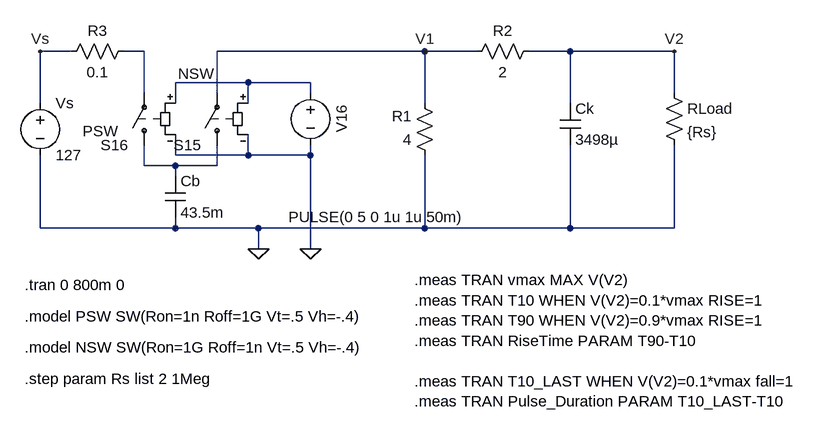
[diagram p0: schematic Pulse generator.asc]
Pulse generator.asc, the LTspice schematic file:
Version 4
SHEET 1 2832 884
WIRE 1488 -464 1440 -464
WIRE 1600 -464 1568 -464
WIRE 2032 -464 1712 -464
WIRE 2112 -464 2032 -464
WIRE 2256 -464 2192 -464
WIRE 2416 -464 2256 -464
WIRE 1760 -416 1648 -416
WIRE 1856 -416 1760 -416
WIRE 1600 -400 1600 -464
WIRE 1712 -400 1712 -464
WIRE 1856 -400 1856 -416
WIRE 2416 -400 2416 -464
WIRE 1440 -384 1440 -464
WIRE 1648 -384 1648 -416
WIRE 1760 -384 1760 -416
WIRE 2032 -384 2032 -464
WIRE 2256 -384 2256 -464
WIRE 1648 -304 1648 -336
WIRE 1760 -304 1760 -336
WIRE 1760 -304 1648 -304
WIRE 1856 -304 1856 -320
WIRE 1856 -304 1760 -304
WIRE 1600 -288 1600 -320
WIRE 1648 -288 1600 -288
WIRE 1712 -288 1712 -320
WIRE 1712 -288 1648 -288
WIRE 1648 -272 1648 -288
WIRE 1440 -192 1440 -304
WIRE 1648 -192 1648 -208
WIRE 1648 -192 1440 -192
WIRE 1776 -192 1648 -192
WIRE 2032 -192 2032 -304
WIRE 2032 -192 1776 -192
WIRE 2256 -192 2256 -320
WIRE 2256 -192 2032 -192
WIRE 2416 -192 2416 -320
WIRE 2416 -192 2256 -192
WIRE 1776 -160 1776 -192
WIRE 1856 -160 1856 -304
FLAG 1776 -160 0
FLAG 1856 -160 0
FLAG 2416 -464 V2
FLAG 2032 -464 V1
FLAG 1440 -464 Vs
SYMBOL voltage 1440 -400 R0
WINDOW 123 0 0 Left 0
WINDOW 39 0 0 Left 0
SYMATTR InstName Vs
SYMATTR Value 127
SYMBOL sw 1712 -304 R180
WINDOW 3 4 126 Left 2
SYMATTR Value NSW
SYMATTR InstName S15
SYMBOL voltage 1856 -416 R0
WINDOW 0 32 56 VTop 2
WINDOW 3 101 223 Bottom 2
WINDOW 123 0 0 Left 0
WINDOW 39 0 0 Left 0
SYMATTR InstName V16
SYMATTR Value PULSE(0 5 0 1u 1u 50m)
SYMBOL sw 1600 -304 R180
WINDOW 3 41 37 Left 2
SYMATTR Value PSW
SYMATTR InstName S16
SYMBOL cap 1632 -272 R0
SYMATTR InstName Cb
SYMATTR Value 43.5m
SYMBOL res 2096 -448 R270
WINDOW 0 32 56 VTop 2
WINDOW 3 0 56 VBottom 2
SYMATTR InstName R2
SYMATTR Value 2
SYMBOL cap 2240 -384 R0
SYMATTR InstName Ck
SYMATTR Value 3498µ
SYMBOL res 2400 -416 R0
SYMATTR InstName RLoad
SYMATTR Value {Rs}
SYMBOL res 2048 -288 R180
WINDOW 0 36 76 Left 2
WINDOW 3 36 40 Left 2
SYMATTR InstName R1
SYMATTR Value 4
SYMBOL res 1584 -480 R90
WINDOW 0 0 56 VBottom 2
WINDOW 3 32 56 VTop 2
SYMATTR InstName R3
SYMATTR Value 0.1
TEXT 1416 -104 Left 2 !.tran 0 800m 0
TEXT 1416 -56 Left 2 !.model PSW SW(Ron=1n Roff=1G Vt=.5 Vh=-.4)
TEXT 1416 -8 Left 2 !.model NSW SW(Ron=1G Roff=1n Vt=.5 Vh=-.4)
TEXT 1416 40 Left 2 !.step param Rs list 2 1Meg
TEXT 2016 -112 Left 2 !.meas TRAN vmax MAX V(V2)\n.meas TRAN T10 WHEN V(V2)=0.1*vmax RISE=1\n.meas TRAN T90 WHEN V(V2)=0.9*vmax RISE=1\n.meas TRAN RiseTime PARAM T90-T10\n \n.meas TRAN T10_LAST WHEN V(V2)=0.1*vmax fall=1\n.meas TRAN Pulse_Duration PARAM T10_LAST-T10

The netlist it stands for:
* Pulse generator.asc
Vs Vs 0 127
S15 N003 V1 N002 0 NSW
V16 N002 0 PULSE(0 5 0 1u 1u 50m)
S16 N003 N001 N002 0 PSW
Cb N003 0 43.5m
R2 V1 V2 2
Ck V2 0 3498µ
RLoad V2 0 {Rs}
R1 0 V1 4
R3 N001 Vs 0.1
.tran 0 800m 0
.model PSW SW(Ron=1n Roff=1G Vt=.5 Vh=-.4)
.model NSW SW(Ron=1G Roff=1n Vt=.5 Vh=-.4)
.step param Rs list 2 1Meg
.meas TRAN vmax MAX V(V2)
.meas TRAN T10 WHEN V(V2)=0.1*vmax RISE=1
.meas TRAN T90 WHEN V(V2)=0.9*vmax RISE=1
.meas TRAN RiseTime PARAM T90-T10
.meas TRAN T10_LAST WHEN V(V2)=0.1*vmax fall=1
.meas TRAN Pulse_Duration PARAM T10_LAST-T10
.backanno
.end